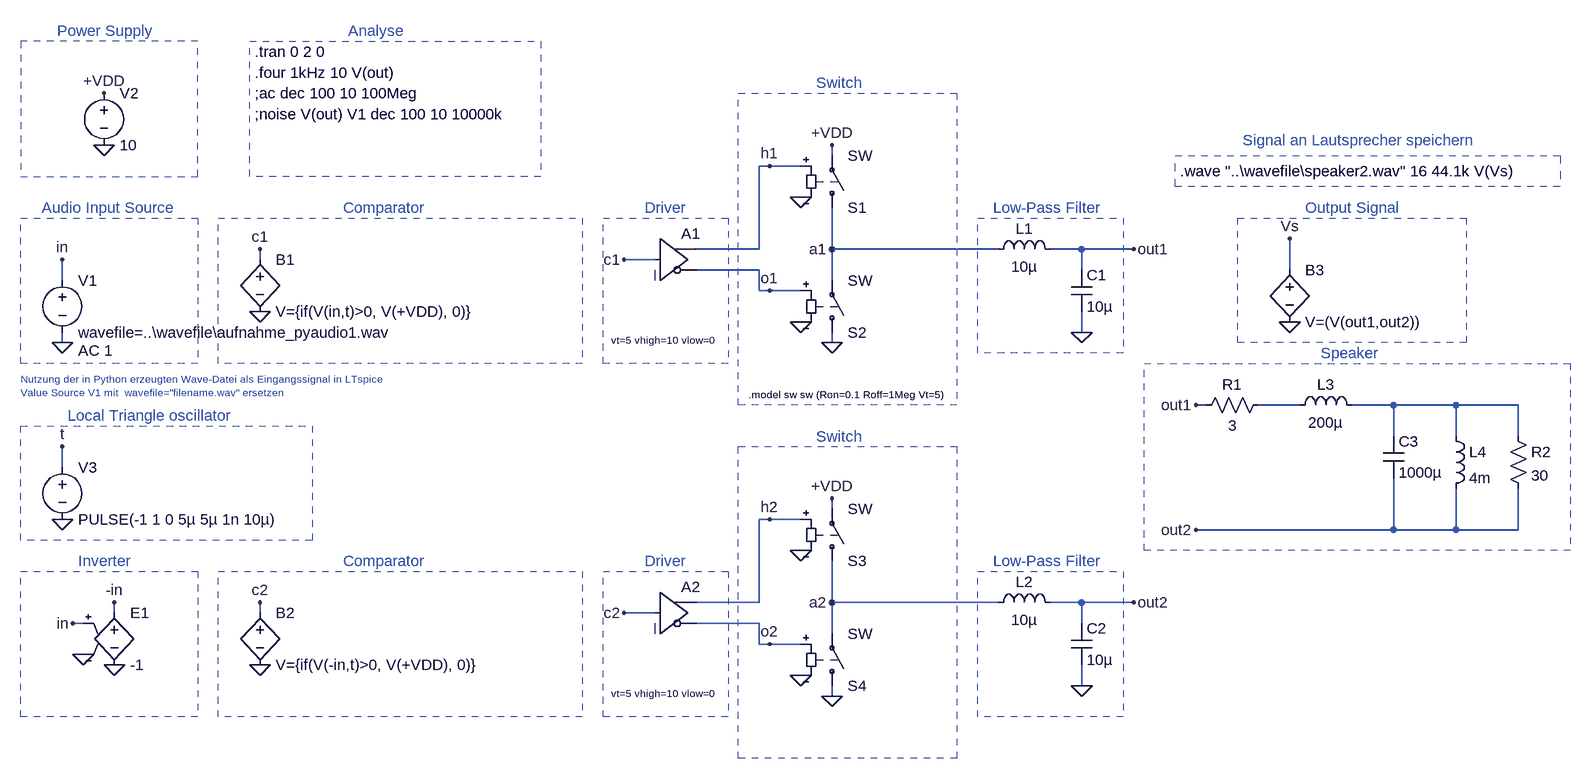
[diagram p0: schematic V6_BD_mit_wave.asc]
V6_BD_mit_wave.asc, the LTspice schematic file:
Version 4
SHEET 1 1764 708
WIRE 256 -224 256 -240
WIRE 160 -208 144 -208
WIRE 208 -208 160 -208
WIRE 144 -80 144 -208
WIRE 144 -80 48 -80
WIRE 256 -80 256 -144
WIRE 512 -80 256 -80
WIRE 640 -80 592 -80
WIRE 720 -80 640 -80
WIRE -624 -64 -624 -80
WIRE -16 -64 -64 -64
WIRE 144 -48 48 -48
WIRE 640 -48 640 -80
WIRE 960 -48 960 -96
WIRE -928 -32 -928 -64
WIRE 256 -32 256 -80
WIRE 144 -16 144 -48
WIRE 160 -16 144 -16
WIRE 208 -16 160 -16
WIRE 640 48 640 16
WIRE -928 64 -928 48
WIRE 256 64 256 48
WIRE 832 160 816 160
WIRE 976 160 912 160
WIRE 1120 160 1056 160
WIRE 1216 160 1120 160
WIRE 1312 160 1216 160
WIRE 1120 208 1120 160
WIRE 1216 208 1216 160
WIRE 1312 208 1312 160
WIRE -928 256 -928 224
WIRE 256 320 256 304
WIRE 160 336 144 336
WIRE 208 336 160 336
WIRE 1120 352 1120 272
WIRE 1120 352 816 352
WIRE 1216 352 1216 288
WIRE 1216 352 1120 352
WIRE 1312 352 1312 288
WIRE 1312 352 1216 352
WIRE 144 464 144 336
WIRE 144 464 48 464
WIRE 256 464 256 400
WIRE 512 464 256 464
WIRE 640 464 592 464
WIRE 720 464 640 464
WIRE -848 480 -848 464
WIRE -624 480 -624 464
WIRE -16 480 -64 480
WIRE -896 496 -912 496
WIRE 144 496 48 496
WIRE 640 496 640 464
WIRE 256 512 256 464
WIRE 144 528 144 496
WIRE 160 528 144 528
WIRE 208 528 160 528
WIRE 640 592 640 560
WIRE 256 608 256 592
FLAG -928 64 0
FLAG -864 -320 +VDD
FLAG -928 224 t
FLAG -64 -64 c1
FLAG 160 -208 h1
FLAG 160 -16 o1
FLAG -928 -64 in
FLAG 256 -80 a1
FLAG -928 336 0
FLAG -864 -240 0
FLAG 640 48 0
FLAG 720 -80 out1
FLAG -624 16 0
FLAG -624 -80 c1
FLAG 256 -240 +VDD
FLAG 160 336 h2
FLAG 160 528 o2
FLAG 256 464 a2
FLAG 640 592 0
FLAG 256 304 +VDD
FLAG 720 464 out2
FLAG -64 480 c2
FLAG 208 -160 0
FLAG 208 32 0
FLAG 256 64 0
FLAG 208 384 0
FLAG 208 576 0
FLAG 256 608 0
FLAG -624 560 0
FLAG -624 464 c2
FLAG -848 560 0
FLAG -896 544 0
FLAG -912 496 in
FLAG -848 464 -in
FLAG 816 160 out1
FLAG 816 352 out2
FLAG 960 32 0
FLAG 960 -96 Vs
SYMBOL voltage -928 -48 R0
WINDOW 123 24 124 Left 2
WINDOW 39 0 0 Left 0
SYMATTR Value2 AC 1
SYMATTR InstName V1
SYMATTR Value wavefile=..\wavefile\aufnahme_pyaudio1.wav
SYMBOL Digital\\buf -16 -128 R0
WINDOW 3 -68 188 Left 1
SYMATTR Value vt=5 vhigh=10 vlow=0
SYMATTR InstName A1
SYMBOL sw 256 -128 M180
SYMATTR InstName S1
SYMBOL sw 256 64 M180
SYMATTR InstName S2
SYMBOL ind 496 -64 R270
WINDOW 0 32 56 VTop 2
WINDOW 3 5 56 VBottom 2
SYMATTR InstName L1
SYMATTR Value 10µ
SYMBOL cap 624 -48 R0
SYMATTR InstName C1
SYMATTR Value 10µ
SYMBOL voltage -864 -336 R0
WINDOW 123 0 0 Left 0
WINDOW 39 0 0 Left 0
SYMATTR InstName V2
SYMATTR Value 10
SYMBOL voltage -928 240 R0
WINDOW 123 0 0 Left 0
WINDOW 39 0 0 Left 0
SYMATTR Value PULSE(-1 1 0 5µ 5µ 1n 10µ)
SYMATTR InstName V3
SYMBOL bv -624 -80 R0
SYMATTR InstName B1
SYMATTR Value V={if(V(in,t)>0, V(+VDD), 0)}
SYMBOL Digital\\buf -16 416 R0
WINDOW 3 -68 188 Left 1
SYMATTR Value vt=5 vhigh=10 vlow=0
SYMATTR InstName A2
SYMBOL sw 256 416 M180
SYMATTR InstName S3
SYMBOL sw 256 608 M180
SYMATTR InstName S4
SYMBOL ind 496 480 R270
WINDOW 0 32 56 VTop 2
WINDOW 3 5 56 VBottom 2
SYMATTR InstName L2
SYMATTR Value 10µ
SYMBOL cap 624 496 R0
SYMATTR InstName C2
SYMATTR Value 10µ
SYMBOL bv -624 464 R0
SYMATTR InstName B2
SYMATTR Value V={if(V(-in,t)>0, V(+VDD), 0)}
SYMBOL e -848 464 R0
SYMATTR InstName E1
SYMATTR Value -1
SYMBOL res 928 144 R90
WINDOW 0 0 56 VBottom 2
WINDOW 3 32 56 VTop 2
SYMATTR InstName R1
SYMATTR Value 3
SYMBOL res 1296 192 R0
SYMATTR InstName R2
SYMATTR Value 30
SYMBOL ind 960 176 R270
WINDOW 0 32 56 VTop 2
WINDOW 3 5 56 VBottom 2
SYMATTR InstName L3
SYMATTR Value 200µ
SYMBOL cap 1104 208 R0
SYMATTR InstName C3
SYMATTR Value 1000µ
SYMBOL ind 1200 192 R0
SYMATTR InstName L4
SYMATTR Value 4m
SYMBOL bv 960 -64 R0
SYMATTR InstName B3
SYMATTR Value V=(V(out1,out2))
TEXT 128 144 Left 1 !.model sw sw (Ron=0.1 Roff=1Meg Vt=5)
TEXT -960 -144 Left 2 ;Audio Input Source
TEXT -920 176 Left 2 ;Local Triangle oscillator
TEXT -632 -384 Left 2 !.tran 0 2 0
TEXT -632 -352 Left 2 !.four 1kHz 10 V(out)
TEXT -632 -320 Left 2 !;ac dec 100 10 100Meg
TEXT -632 -288 Left 2 !;noise V(out) V1 dec 100 10 10000k
TEXT -936 -416 Left 2 ;Power Supply
TEXT -488 -416 Left 2 ;Analyse
TEXT -496 -144 Left 2 ;Comparator
TEXT 232 -336 Left 2 ;Switch
TEXT 504 -144 Left 2 ;Low-Pass Filter
TEXT 1008 80 Left 2 ;Speaker
TEXT -32 -144 Left 2 ;Driver
TEXT -992 120 Left 1 ;Nutzung der in Python erzeugten Wave-Datei als Eingangssignal in LTspice\nValue Source V1 mit  wavefile="filename.wav" ersetzen
TEXT 232 208 Left 2 ;Switch
TEXT 504 400 Left 2 ;Low-Pass Filter
TEXT -32 400 Left 2 ;Driver
TEXT -496 400 Left 2 ;Comparator
TEXT -904 400 Left 2 ;Inverter
TEXT 792 -200 Left 2 !.wave "..\\wavefile\\speaker2.wav" 16 44.1k V(Vs)
TEXT 888 -248 Left 2 ;Signal an Lautsprecher speichern
TEXT 984 -144 Left 2 ;Output Signal
RECTANGLE Normal -720 96 -992 -128 2
RECTANGLE Normal 96 96 -96 -128 2
RECTANGLE Normal 448 160 112 -320 2
RECTANGLE Normal 704 80 480 -128 2
RECTANGLE Normal -720 -400 -992 -192 2
RECTANGLE Normal -192 -192 -640 -400 2
RECTANGLE Normal 1392 384 736 96 2
RECTANGLE Normal -544 368 -992 192 2
RECTANGLE Normal -128 96 -688 -128 2
RECTANGLE Normal 96 640 -96 416 2
RECTANGLE Normal 448 704 112 224 2
RECTANGLE Normal 704 640 480 416 2
RECTANGLE Normal -128 640 -688 416 2
RECTANGLE Normal -720 640 -992 416 2
RECTANGLE Normal 1376 -176 784 -224 2
RECTANGLE Normal 1232 64 880 -128 2

The netlist it stands for:
* V6_BD_mit_wave.asc
V1 in 0 wavefile=..\wavefile\aufnahme_pyaudio1.wav AC 1
A1 c1 0 0 0 0 o1 h1 0 BUF vt=5 vhigh=10 vlow=0
S1 a1 +VDD h1 0 SW
S2 0 a1 o1 0 SW
L1 a1 out1 10µ
C1 out1 0 10µ
V2 +VDD 0 10
V3 t 0 PULSE(-1 1 0 5µ 5µ 1n 10µ)
B1 c1 0 V={if(V(in,t)>0, V(+VDD), 0)}
A2 c2 0 0 0 0 o2 h2 0 BUF vt=5 vhigh=10 vlow=0
S3 a2 +VDD h2 0 SW
S4 0 a2 o2 0 SW
L2 a2 out2 10µ
C2 out2 0 10µ
B2 c2 0 V={if(V(-in,t)>0, V(+VDD), 0)}
E1 -in 0 in 0 -1
R1 N001 out1 3
R2 N002 out2 30
L3 N001 N002 200µ
C3 N002 out2 1000µ
L4 N002 out2 4m
B3 Vs 0 V=(V(out1,out2))
.model sw sw (Ron=0.1 Roff=1Meg Vt=5)
* Audio Input Source
* Local Triangle oscillator
.tran 0 2 0
.four 1kHz 10 V(out)
;ac dec 100 10 100Meg
;noise V(out) V1 dec 100 10 10000k
* Power Supply
* Analyse
* Comparator
* Switch
* Low-Pass Filter
* Speaker
* Driver
* Nutzung der in Python erzeugten Wave-Datei als Eingangssignal in LTspice
* Value Source V1 mit  wavefile="filename.wav" ersetzen
* Switch
* Low-Pass Filter
* Driver
* Comparator
* Inverter
.wave "..\wavefile\speaker2.wav" 16 44.1k V(Vs)
* Signal an Lautsprecher speichern
* Output Signal
.backanno
.end